# Altium schematic sheet DVI-I.SchDoc: Apalis Evaluation Board 1.1
size A3; Organization: Toradex AG; Address1: Altsagenstrasse 5; Address2: Horw; Address3: 6048; Address4: Switzerland; DocumentNumber: 21; Revision: V1.1; SheetNumber: 21; SheetTotal: 32; PageSetup: Record=PageOptions|CenterHorizontal=True|CenterVertical=True|PrintScale=0.71|XCorrection=1.00|YCorrection=1.00|PrintKind=0|BorderSize=5000000|LeftOffset=0|BottomOffset=0|Orientation=2|PaperLength=1000|PaperWidth=1000|Scale=100|PaperSource=7|PrintQuality=-4|MediaType=1|DitherType=10|PaperKind=A4|PrintScaleMode=1
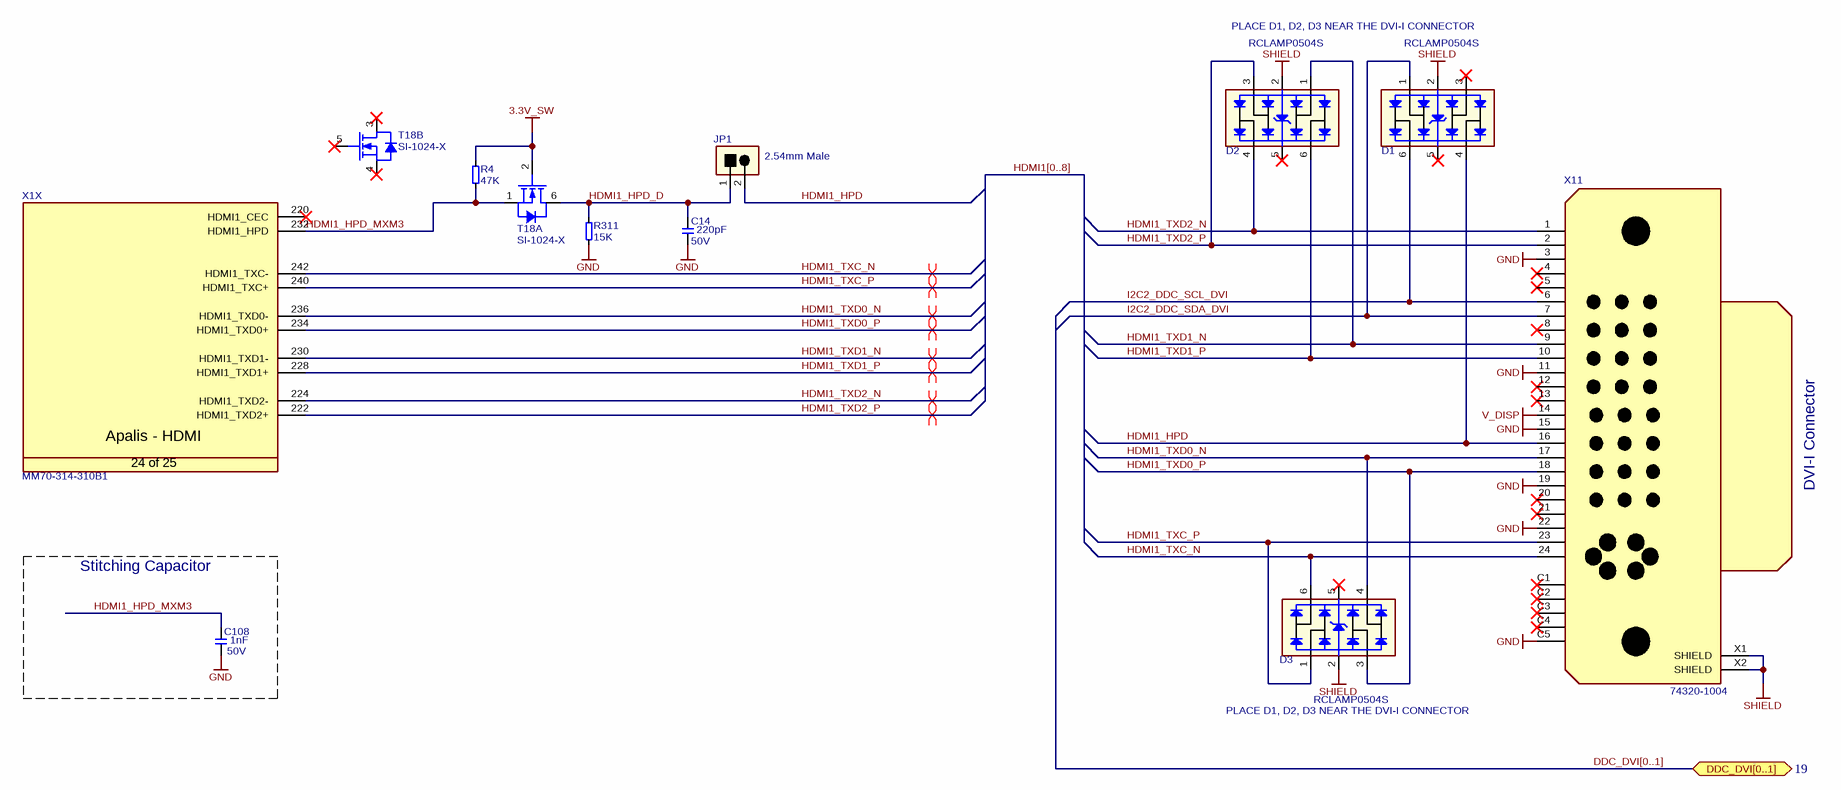
[diagram p0: DVI-I.SchDoc]

## Parts
C14  Rating: 50V  [T_CAPC0603X33N]  (hidden comment: 220pF)
C108  Rating: 50V  [CAPC1005X60N]  (hidden comment: 1nF)
D1  RCLAMP0504S  [T_SOT95P285X90-6N]
D2  RCLAMP0504S  [T_SOT95P285X90-6N]
D3  RCLAMP0504S  [T_SOT95P285X90-6N]
JP1  TSW-101-07-G-D  [T_Samtec_TSW-101-07-G-D]  (value not drawn)
R4  47K  [T_RESC0603X30N]
R311  15K  [T_RESC0603X30N]
T18  Manufacturer Part No.: SI-1024-X  [SOTFL50P160X60-6N]  (hidden comment: T-Vishay-SI-1024X-N)  (parts A,B of 2)
X1  Manufacturer Part No.: MM70-314-310B1  [T_JAE_MM70-314-310B1]  (hidden comment: CON-JAE-MM70-314-310B1-314-0.5mm)  (part X of 25)
X11  Manufacturer Part No.: 74320-1004  [T_MOLEX_74320-1004]  (hidden comment: CON-Molex-74320-1004-31)

## Blocks framed on the sheet
Stitching Capacitor: C108

## Ports
DDC_DVI[0..1] (bidir, see 19)

## Nets
3.3V_SW: R4.2 T18.2(G)
GND: C14.2 C108.1 R311.1 X11.3(GND) X11.11(GND) X11.15(GND) X11.19(GND) X11.22(GND) X11.C5(GND)
SHIELD: D1.2 D2.2 D3.2 X11.X1(SHIELD) X11.X2(SHIELD)
V_DISP: X11.14(VDD_DVI)
HDMI1_HPD: D1.4 JP1.2 X11.16(HOTPLUG_DETECT)
HDMI1_HPD_D: C14.1 JP1.1 R311.2 T18.6(D)
HDMI1_HPD_MXM3: C108.2 R4.1 T18.1(S) X1.232(HDMI1_HPD)
HDMI1_TXC_N: D3.6 X1.242(HDMI1_TXC-) X11.24(TMDS_CLK_N)
HDMI1_TXC_P: D3.1 X1.240(HDMI1_TXC+) X11.23(TMDS_CLK_P)
HDMI1_TXD0_N: D3.4 X1.236(HDMI1_TXD0-) X11.17(TMDS_DATA0_N)
HDMI1_TXD0_P: D3.3 X1.234(HDMI1_TXD0+) X11.18(TMDS_DATA0_P)
HDMI1_TXD1_N: D2.1 X1.230(HDMI1_TXD1-) X11.9(TMDS_DATA1_N)
HDMI1_TXD1_P: D2.6 X1.228(HDMI1_TXD1+) X11.10(TMDS_DATA1_P)
HDMI1_TXD2_N: D2.4 X1.224(HDMI1_TXD2-) X11.1(TMDS_DATA2_N)
HDMI1_TXD2_P: D2.3 X1.222(HDMI1_TXD2+) X11.2(TMDS_DATA2_P)
I2C2_DDC_SCL_DVI: D1.6 X11.6(DDC_CLK)
I2C2_DDC_SDA_DVI: D1.1 X11.7(DDC_DATA)

Not connected (* = marked no-connect by the designer): D1 3* 5*; D2 5*; D3 5*; T18 3(D)* 4(S)* 5(G)*; X1 220(HDMI1_CEC)*; X11 4(TMDS_DATA4_N)* 5(TMDS_DATA4_P)* 8(CRT_VSYNC)* 12(TMDS_DATA3_N)* 13(TMDS_DATA3_P)* 20(TMDS_DATA5_N)* 21(TMDS_DATA5_P)* C1(CRT_RED)* C2(CRT_GREEN)* C3(CRT_BLUE)* C4(CRT_HSYNC)*

## Buses and harness runs
bus DDC_DVI[0..1] = port DDC_DVI[0..1]
bus HDMI1[0..8]

## Layout directives
differential pair: HDMI1_TXC_N, HDMI1_TXC_P, HDMI1_TXD0_N, HDMI1_TXD0_P, HDMI1_TXD1_N, HDMI1_TXD1_P, HDMI1_TXD2_N, HDMI1_TXD2_P

## Notes on the sheet
- PLACE D1, D2, D3 NEAR THE DVI-I CONNECTOR
- (near JP1) 2.54mm Male
- DVI-I Connector
- (near D3) PLACE D1, D2, D3 NEAR THE DVI-I CONNECTOR
- Title
- Size:
- Date:
- A3
- Number:
- Time:
- Revision:
- Sheet
- of
- File:
- (in symbol CON-JAE-MM70-314-310B1-314-0.5mm, part X) Apalis - HDMI; 24 of 25

## Library data of the parts
C14 = C-X7R-220pF-50V-20%-0603: Capacitor Ceramic X7R 220pF 50V 20% 0603; Tolerance: 20%; Type: X7R; Value: 220pF
C108 = C-X7R-1nF-50V-10%-0402: Capacitor Ceramic X7R 1nF 50V 10% 0402; Tolerance: 10%; Type: X7R; Value: 1nF
D1-D3 = D-Semtech-RClamp0504S: TVS Array low cap; Manufacturer Name: Semtech; Manufacturer Part No.: RCLAMP0504S
JP1 = CON-Samtec-TSW-101-07-G-D: Header male, 1x2 Pins, 2.54 mm pitch; Manufacturer Name: Samtec; Pitch: 2.54 mm; No. of ways: 1x2; Manufacturer Part no.: TSW-101-07-G-D
R4 = R-47KR-63mW-5%-0603: Resistor 47 Kohm 63mW 5% 0603; Value: 47KR; Rating: 63mW; Tolerance: 5%
R311 = R-15KR-63mW-5%-0603: Resistor 15 Kohm 63mW 5% 0603; Value: 15KR; Rating: 63mW; Tolerance: 5%
T18 = T-Vishay-SI-1024X-N: Dual N-Channel 20V (D-S)  MOSFET; Manufacturer Name: Vishay
X1 = CON-JAE-MM70-314-310B1-314-0.5mm: MXM3 Connector; Manufacturer Name: JAE; No. of ways: 314
X11 = CON-Molex-74320-1004-31: DVI Connector; Manufacturer Name: Molex; No. of ways: 31